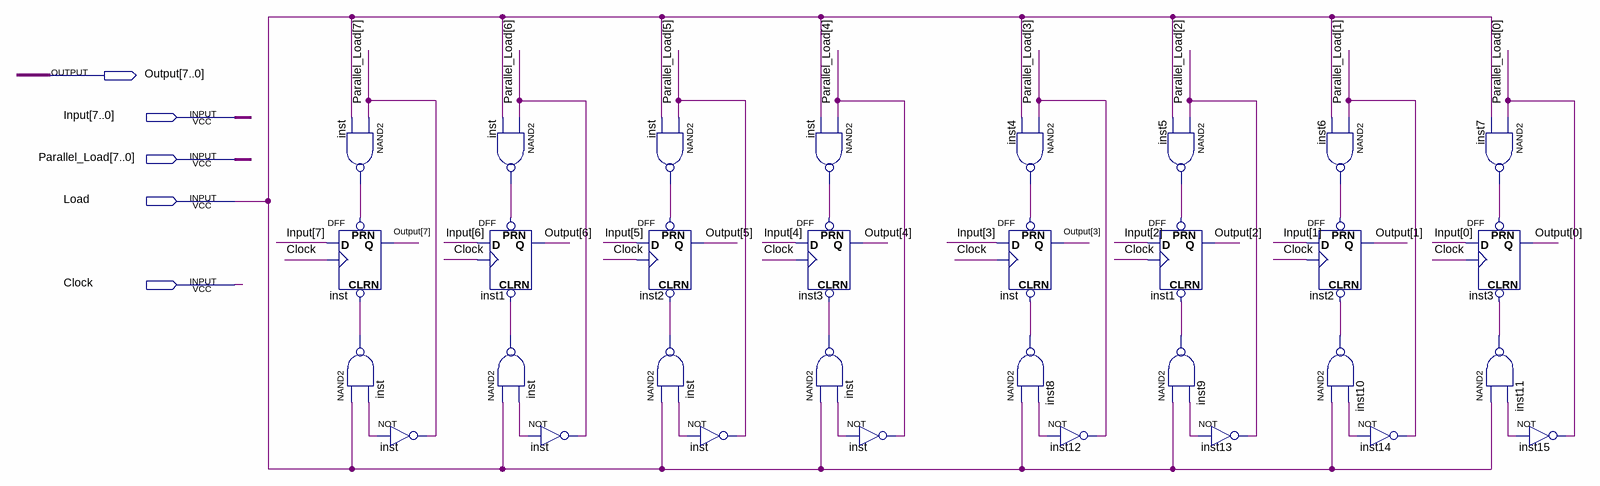
[diagram p0: schematic sheet]
// Quartus schematic REGISTER8bit.bdf as structural Verilog: 32 symbols, 5 pins
module REGISTER8bit (
  input  [7:0] Input,
  input  [7:0] Parallel_Load,
  input  Load,
  input  Clock,
  output [7:0] Output
);

  wire inst4_out, inst5_out, inst6_out, inst7_out, inst8_out, inst9_out, inst10_out, inst11_out, inst_out,
       inst_out_2, inst_out_3, inst_out_4, inst_out_5, inst_out_6, inst_out_7, inst_out_8, undriven,
       undriven_2, undriven_3, undriven_4, undriven_5, undriven_6, undriven_7, undriven_8;

  nand inst (inst_out, Parallel_Load[7], Load);
  DFF inst_dup2 (.CLRN(inst_out_6), .CLK(Clock), .D(Input[7]), .PRN(inst_out), .Q(Output[7]));
  nand inst_dup3 (inst_out_6, Load, undriven);
  not inst_dup4 (Parallel_Load[7], undriven);
  nand inst_dup5 (inst_out_2, Parallel_Load[6], Load);
  DFF inst1 (.CLRN(inst_out_5), .CLK(Clock), .D(Input[6]), .PRN(inst_out_2), .Q(Output[6]));
  nand inst_dup6 (inst_out_5, Load, undriven_2);
  not inst_dup7 (Parallel_Load[6], undriven_2);
  nand inst_dup8 (inst_out_3, Parallel_Load[5], Load);
  DFF inst2 (.CLRN(inst_out_4), .CLK(Clock), .D(Input[5]), .PRN(inst_out_3), .Q(Output[5]));
  nand inst_dup9 (inst_out_4, Load, undriven_3);
  not inst_dup10 (Parallel_Load[5], undriven_3);
  nand inst_dup11 (inst_out_7, Parallel_Load[4], Load);
  DFF inst3 (.CLRN(inst_out_8), .CLK(Clock), .D(Input[4]), .PRN(inst_out_7), .Q(Output[4]));
  nand inst_dup12 (inst_out_8, Load, undriven_4);
  not inst_dup13 (Parallel_Load[4], undriven_4);
  nand inst4 (inst4_out, Parallel_Load[3], Load);
  DFF inst_dup14 (.CLRN(inst8_out), .CLK(Clock), .D(Input[3]), .PRN(inst4_out), .Q(Output[3]));
  nand inst8 (inst8_out, Load, undriven_5);
  not inst12 (Parallel_Load[3], undriven_5);
  nand inst5 (inst5_out, Parallel_Load[2], Load);
  DFF inst1_dup2 (.CLRN(inst9_out), .CLK(Clock), .D(Input[2]), .PRN(inst5_out), .Q(Output[2]));
  nand inst9 (inst9_out, Load, undriven_6);
  not inst13 (Parallel_Load[2], undriven_6);
  nand inst6 (inst6_out, Parallel_Load[1], Load);
  DFF inst2_dup2 (.CLRN(inst10_out), .CLK(Clock), .D(Input[1]), .PRN(inst6_out), .Q(Output[1]));
  nand inst10 (inst10_out, Load, undriven_7);
  not inst14 (Parallel_Load[1], undriven_7);
  nand inst7 (inst7_out, Parallel_Load[0], Load);
  DFF inst3_dup2 (.CLRN(inst11_out), .CLK(Clock), .D(Input[0]), .PRN(inst7_out), .Q(Output[0]));
  nand inst11 (inst11_out, Load, undriven_8);
  not inst15 (Parallel_Load[0], undriven_8);
endmodule
